# Altium schematic sheet 5_FPGA_Banks_4_7.SchDoc
size A4; Organization: SpaceLab UFSC; Address1: UFSC - SpaceLab; Address2: University Campus - Trindade; Address3: Dep. of Electrical Engineering - CTC; Address4: Florianópolis, Santa Catarina, Brazil; Address5: CEP: 88040 - 900
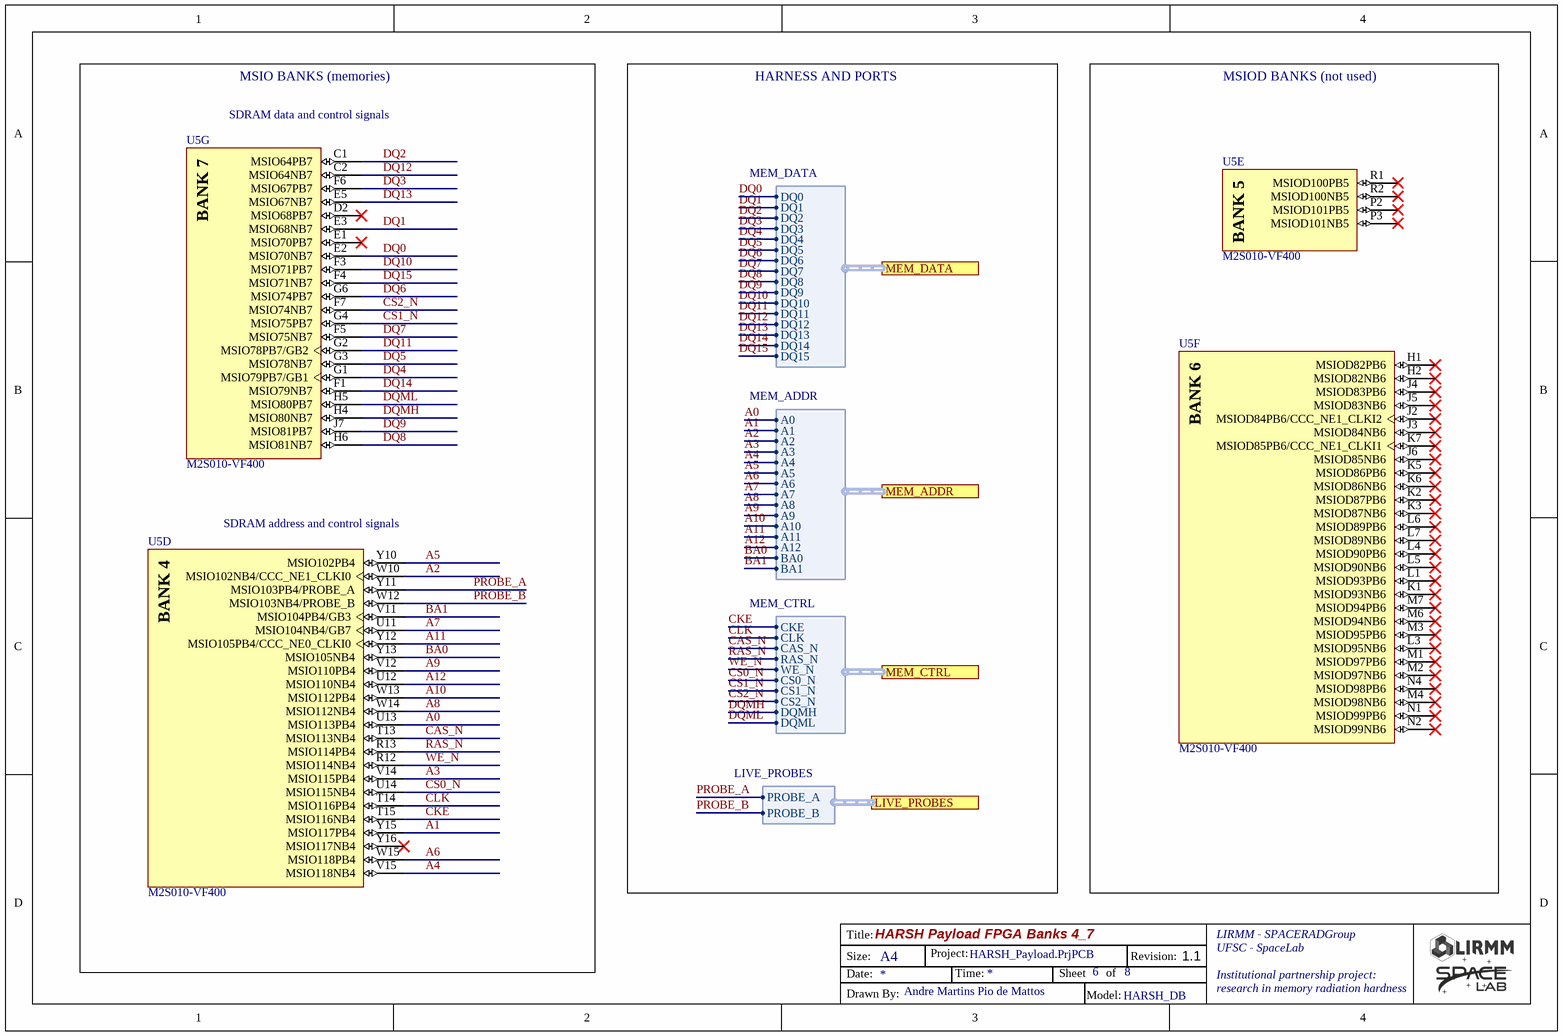
[diagram p0: 5_FPGA_Banks_4_7.SchDoc]

## Parts
U5  M2S010-VF400  [DONE_MCSM_VF_400]  (parts D,E,F,G of 14)

## Blocks framed on the sheet
MSIO BANKS (memories): U5
MSIOD BANKS (not used): U5

## Ports
LIVE_PROBES (harness LIVE_PROBES), MEM_ADDR (harness MEM_ADDR), MEM_CTRL (harness MEM_CTRL), MEM_DATA (harness MEM_DATA)

## Harnesses
MEM_DATA: DQ0, DQ1, DQ2, DQ3, DQ4, DQ5, DQ6, DQ7, DQ8, DQ9, DQ10, DQ11, DQ12, DQ13, DQ14, DQ15
MEM_ADDR: A0, A1, A2, A3, A4, A5, A6, A7, A8, A9, A10, A11, A12, BA0, BA1
MEM_CTRL: CKE, CLK, CAS_N, RAS_N, WE_N, CS0_N, CS1_N, CS2_N, DQMH, DQML
LIVE_PROBES: PROBE_A, PROBE_B

## Nets
A0: U5.U13(MSIO113PB4) ; port MEM_ADDR.A0
A1: U5.Y15(MSIO117PB4) ; port MEM_ADDR.A1
A2: U5.W10(MSIO102NB4/CCC_NE1_CLKI0) ; port MEM_ADDR.A2
A3: U5.V14(MSIO115PB4) ; port MEM_ADDR.A3
A4: U5.V15(MSIO118NB4) ; port MEM_ADDR.A4
A5: U5.Y10(MSIO102PB4) ; port MEM_ADDR.A5
A6: U5.W15(MSIO118PB4) ; port MEM_ADDR.A6
A7: U5.U11(MSIO104NB4/GB7) ; port MEM_ADDR.A7
A8: U5.W14(MSIO112NB4) ; port MEM_ADDR.A8
A9: U5.V12(MSIO110PB4) ; port MEM_ADDR.A9
A10: U5.W13(MSIO112PB4) ; port MEM_ADDR.A10
A11: U5.Y12(MSIO105PB4/CCC_NE0_CLKI0) ; port MEM_ADDR.A11
A12: U5.U12(MSIO110NB4) ; port MEM_ADDR.A12
BA0: U5.Y13(MSIO105NB4) ; port MEM_ADDR.BA0
BA1: U5.V11(MSIO104PB4/GB3) ; port MEM_ADDR.BA1
CAS_N: U5.T13(MSIO113NB4) ; port MEM_CTRL.CAS_N
CKE: U5.T15(MSIO116NB4) ; port MEM_CTRL.CKE
CLK: U5.T14(MSIO116PB4) ; port MEM_CTRL.CLK
CS0_N: U5.U14(MSIO115NB4) ; port MEM_CTRL.CS0_N
CS1_N: U5.G4(MSIO75PB7) ; port MEM_CTRL.CS1_N
CS2_N: U5.F7(MSIO74NB7) ; port MEM_CTRL.CS2_N
DQ0: U5.E2(MSIO70NB7) ; port MEM_DATA.DQ0
DQ1: U5.E3(MSIO68NB7) ; port MEM_DATA.DQ1
DQ2: U5.C1(MSIO64PB7) ; port MEM_DATA.DQ2
DQ3: U5.F6(MSIO67PB7) ; port MEM_DATA.DQ3
DQ4: U5.G1(MSIO79PB7/GB1) ; port MEM_DATA.DQ4
DQ5: U5.G3(MSIO78NB7) ; port MEM_DATA.DQ5
DQ6: U5.G6(MSIO74PB7) ; port MEM_DATA.DQ6
DQ7: U5.F5(MSIO75NB7) ; port MEM_DATA.DQ7
DQ8: U5.H6(MSIO81NB7) ; port MEM_DATA.DQ8
DQ9: U5.J7(MSIO81PB7) ; port MEM_DATA.DQ9
DQ10: U5.F3(MSIO71PB7) ; port MEM_DATA.DQ10
DQ11: U5.G2(MSIO78PB7/GB2) ; port MEM_DATA.DQ11
DQ12: U5.C2(MSIO64NB7) ; port MEM_DATA.DQ12
DQ13: U5.E5(MSIO67NB7) ; port MEM_DATA.DQ13
DQ14: U5.F1(MSIO79NB7) ; port MEM_DATA.DQ14
DQ15: U5.F4(MSIO71NB7) ; port MEM_DATA.DQ15
DQMH: U5.H4(MSIO80NB7) ; port MEM_CTRL.DQMH
DQML: U5.H5(MSIO80PB7) ; port MEM_CTRL.DQML
PROBE_A: U5.Y11(MSIO103PB4/PROBE_A) ; port LIVE_PROBES.PROBE_A
PROBE_B: U5.W12(MSIO103NB4/PROBE_B) ; port LIVE_PROBES.PROBE_B
RAS_N: U5.R13(MSIO114PB4) ; port MEM_CTRL.RAS_N
WE_N: U5.R12(MSIO114NB4) ; port MEM_CTRL.WE_N

Not connected (* = marked no-connect by the designer): U5 D2(MSIO68PB7)* E1(MSIO70PB7)* H1(MSIOD82PB6)* H2(MSIOD82NB6)* J2(MSIOD84PB6/CCC_NE1_CLKI2)* J3(MSIOD84NB6)* J4(MSIOD83PB6)* J5(MSIOD83NB6)* J6(MSIOD85NB6)* K1(MSIOD93NB6)* K2(MSIOD87PB6)* K3(MSIOD87NB6)* K5(MSIOD86PB6)* K6(MSIOD86NB6)* K7(MSIOD85PB6/CCC_NE1_CLKI1)* L1(MSIOD93PB6)* L3(MSIOD95NB6)* L4(MSIOD90PB6)* L5(MSIOD90NB6)* L6(MSIOD89PB6)* L7(MSIOD89NB6)* M1(MSIOD97PB6)* M2(MSIOD97NB6)* M3(MSIOD95PB6)* M4(MSIOD98NB6)* M6(MSIOD94NB6)* M7(MSIOD94PB6)* N1(MSIOD99PB6)* N2(MSIOD99NB6)* N4(MSIOD98PB6)* P2(MSIOD101PB5)* P3(MSIOD101NB5)* R1(MSIOD100PB5)* R2(MSIOD100NB5)* Y16(MSIO117NB4)*

## Notes on the sheet
- HARNESS AND PORTS
- (near U5) SDRAM data and control signals
- (near U5) SDRAM address and control signals
- HARSH Payload FPGA Banks 4_7
- HARSH_Payload.PrjPCB
- 6
- 8
- 1.1
- Andre Martins Pio de Mattos
- HARSH_DB
- Title:
- Size:
- Date:
- A4
- Project:
- Time:
- Sheet
- of
- Revision:
- LIRMM - SPACERADGroup
- UFSC - SpaceLab
- Institutional partnership project:
- research in memory radiation hardness
- Drawn By:
- Model:
- (in symbol DONE_M2S010-VF400, part D) BANK 4
- (in symbol DONE_M2S010-VF400, part E) BANK 5
- (in symbol DONE_M2S010-VF400, part F) BANK 6
- (in symbol DONE_M2S010-VF400, part G) BANK 7

## Library data of the parts
U5 = DONE_M2S010-VF400: SmartFusion2 SoC FPGA, ARM Cortex-M3, 10 K LUTs, 195 User I/O, Design Security, 0 to 85 degC, 400-Ball BGA; Manufacturer: Microsemi; DDR Controllers (Count x Width): 1x18; MSIO (3.3V): 99; PLLs and CCCs: 2; eSRAM (K Bytes) Non SECDED: 80; SERDES Lanes: 4; Total User I/O: 195; eSRAM (K Bytes): 64; uSRAM1K Blocks: 22; Maximum Logic Elements: 12,084; MSIOD (2.5V): 32; eNVM (K Bytes): 256; Total RAM (K bits): 400; LSRAM 18K Blocks: 21; PartNumber: M2S010-VF400; PackageVersion: Rev. 48, 11/2013; ComponentLink1Description: Manufacturer URL; ComponentLink2Description: Datasheet; DatasheetVersion: Rev. 5; ComponentLink3URL: http://www.microsemi.com/document-portal/doc_download/131095-package-mechanical-drawings; ComponentLink1URL: http://www.microsemi.com/; ComponentLink2URL: http://www.microsemi.com/document-portal/doc_download/130717-smartfusion2-datasheet; PackageReference: VF-400; ComponentLink3Description: Package Specification; Math Blocks (18x18): 22; RoHS: FALSE; DDRIO (2.5V): 64; Mounting Technology: Surface Mount; PackageDescription: 400-Ball Very Fine Pitch Ball Grid Array, Body 17 x 17 mm, Pitch 0.8 mm